# EAGLE design ContactlessMain (EAGLE 9.6.2)
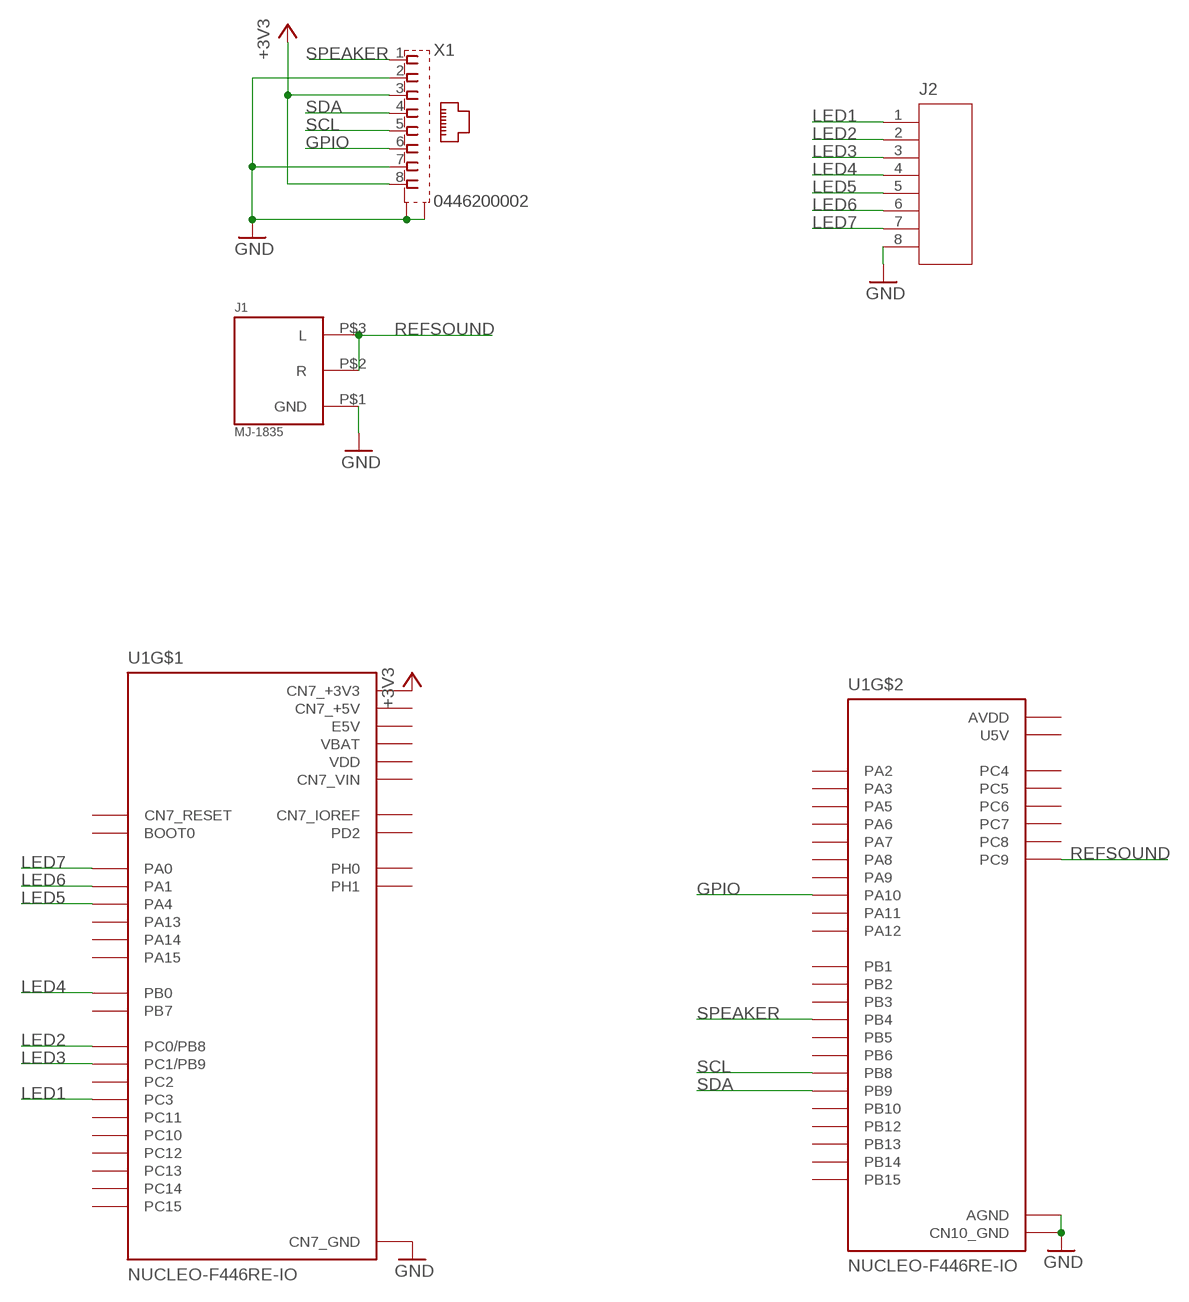
[diagram p0: schematic, sheet 1]

## Parts
J1  MJ-1835  [MJ-1835]
J2  PINHEADER-818*1  [PINHEADER-8*1]
U1  NUCLEO-F446RE-IO  [MODULE_NUCLEO-F446RE]
X1  0446200002  [0446200002]

## Nets
+3V3: U1.CN7_16(CN7_+3V3) X1.3 X1.8
GND: J1.P$1(GND) J2.8 U1.CN7_8(CN7_GND) U1.CN7_19(CN7_GND) U1.CN7_20(CN7_GND) U1.CN7_22(CN7_GND) U1.CN10_9(CN10_GND) U1.CN10_20(CN10_GND) U1.CN10_32(AGND) X1.2 X1.7 X1.S@1(S1) X1.S@2(S2)
GPIO: U1.CN10_33(PA10) X1.6
LED1: J2.1 U1.CN7_37(PC3)
LED2: J2.2 U1.CN7_38(PC0/PB8)
LED3: J2.3 U1.CN7_36(PC1/PB9)
LED4: J2.4 U1.CN7_34(PB0)
LED5: J2.5 U1.CN7_32(PA4)
LED6: J2.6 U1.CN7_30(PA1)
LED7: J2.7 U1.CN7_28(PA0)
REFSOUND: J1.P$2(R) J1.P$3(L) U1.CN10_1(PC9)
SCL: U1.CN10_3(PB8) X1.5
SDA: U1.CN10_5(PB9) X1.4
SPEAKER: U1.CN10_27(PB4) X1.1
Unconnected: U1.CN7_1(PC10) U1.CN7_2(PC11) U1.CN7_3(PC12) U1.CN7_4(PD2) U1.CN7_7(BOOT0) U1.CN7_12(CN7_IOREF) U1.CN7_13(PA13) U1.CN7_14(CN7_RESET) U1.CN7_15(PA14) U1.CN7_17(PA15) U1.CN7_21(PB7) U1.CN7_23(PC13) U1.CN7_25(PC14) U1.CN7_27(PC15) U1.CN7_29(PH0) U1.CN7_31(PH1) U1.CN7_35(PC2) U1.CN10_2(PC8) U1.CN10_4(PC6) U1.CN10_6(PC5) U1.CN10_11(PA5) U1.CN10_12(PA12) U1.CN10_13(PA6) U1.CN10_14(PA11) U1.CN10_15(PA7) U1.CN10_16(PB12) U1.CN10_17(PB6) U1.CN10_19(PC7) U1.CN10_21(PA9) U1.CN10_22(PB2) U1.CN10_23(PA8) U1.CN10_24(PB1) U1.CN10_25(PB10) U1.CN10_26(PB15) U1.CN10_28(PB14) U1.CN10_29(PB5) U1.CN10_30(PB13) U1.CN10_31(PB3) U1.CN10_34(PC4) U1.CN10_35(PA2) U1.CN10_37(PA3)

## Power pins joined to a net without a drawn wire
AVDD: U1.CN10_7(AVDD)
CN7_+5V: U1.CN7_18(CN7_+5V)
CN7_VIN: U1.CN7_24(CN7_VIN)
E5V: U1.CN7_6(E5V)
U5V: U1.CN10_8(U5V)
VBAT: U1.CN7_33(VBAT)
VDD: U1.CN7_5(VDD)

## Library data of the parts
J1 = AUDIO:MJ-1835
J2 = PINHEADER:PINHEADER-8*1
U1 = NUCLEO-F446RE-IO:NUCLEO-F446RE-IO
X1 = con-molex:0446200002: RJ-45 INVERTED MODULAR JACK ASSEMBLY WITH RJ-11 KEEPOUT FEATURE Source: Data sheet <http://www.farnell.com/datasheets/73207.pdf> MOLEX 0446200002 BUCHSE, RJ45, GESCHIRMT Source: Farnell <http://de.farnell.com/molex/0446200002/buchse-rj45-geschirmt/dp/9251910?ost=9251910>; MF: MOLEX; MPN: 0446200002; OC_FARNELL: 9251910

## Board
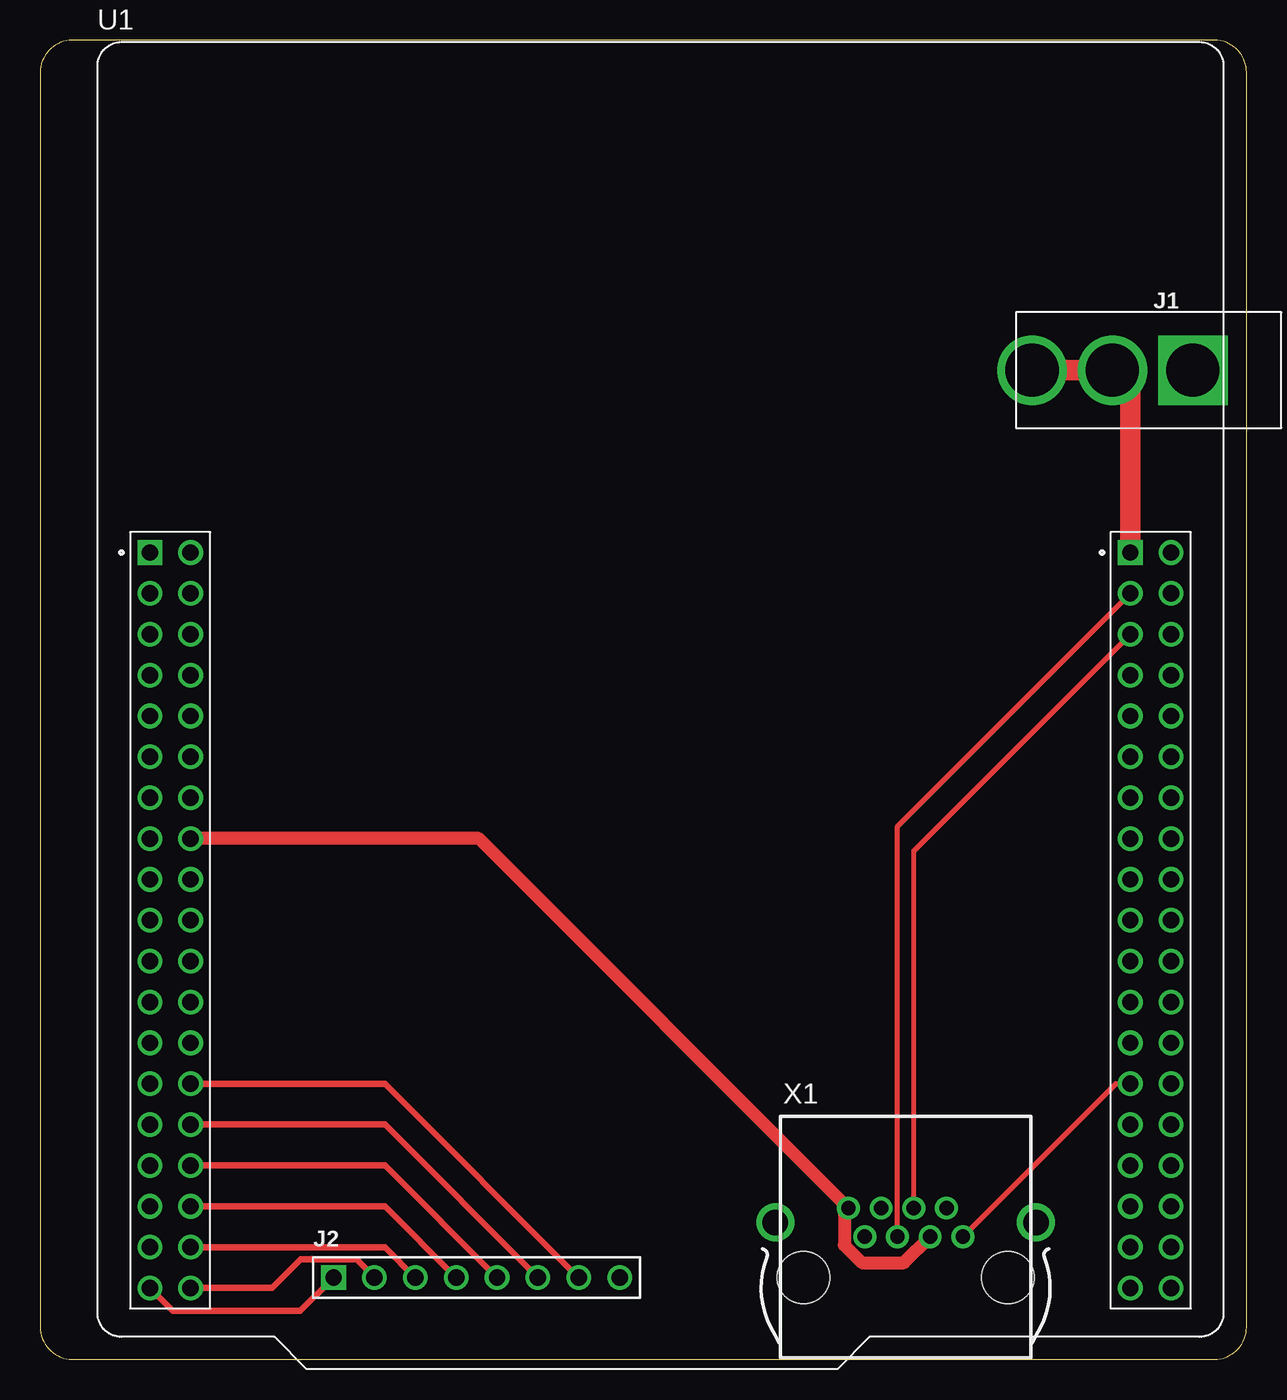
[diagram p1: board, top side]
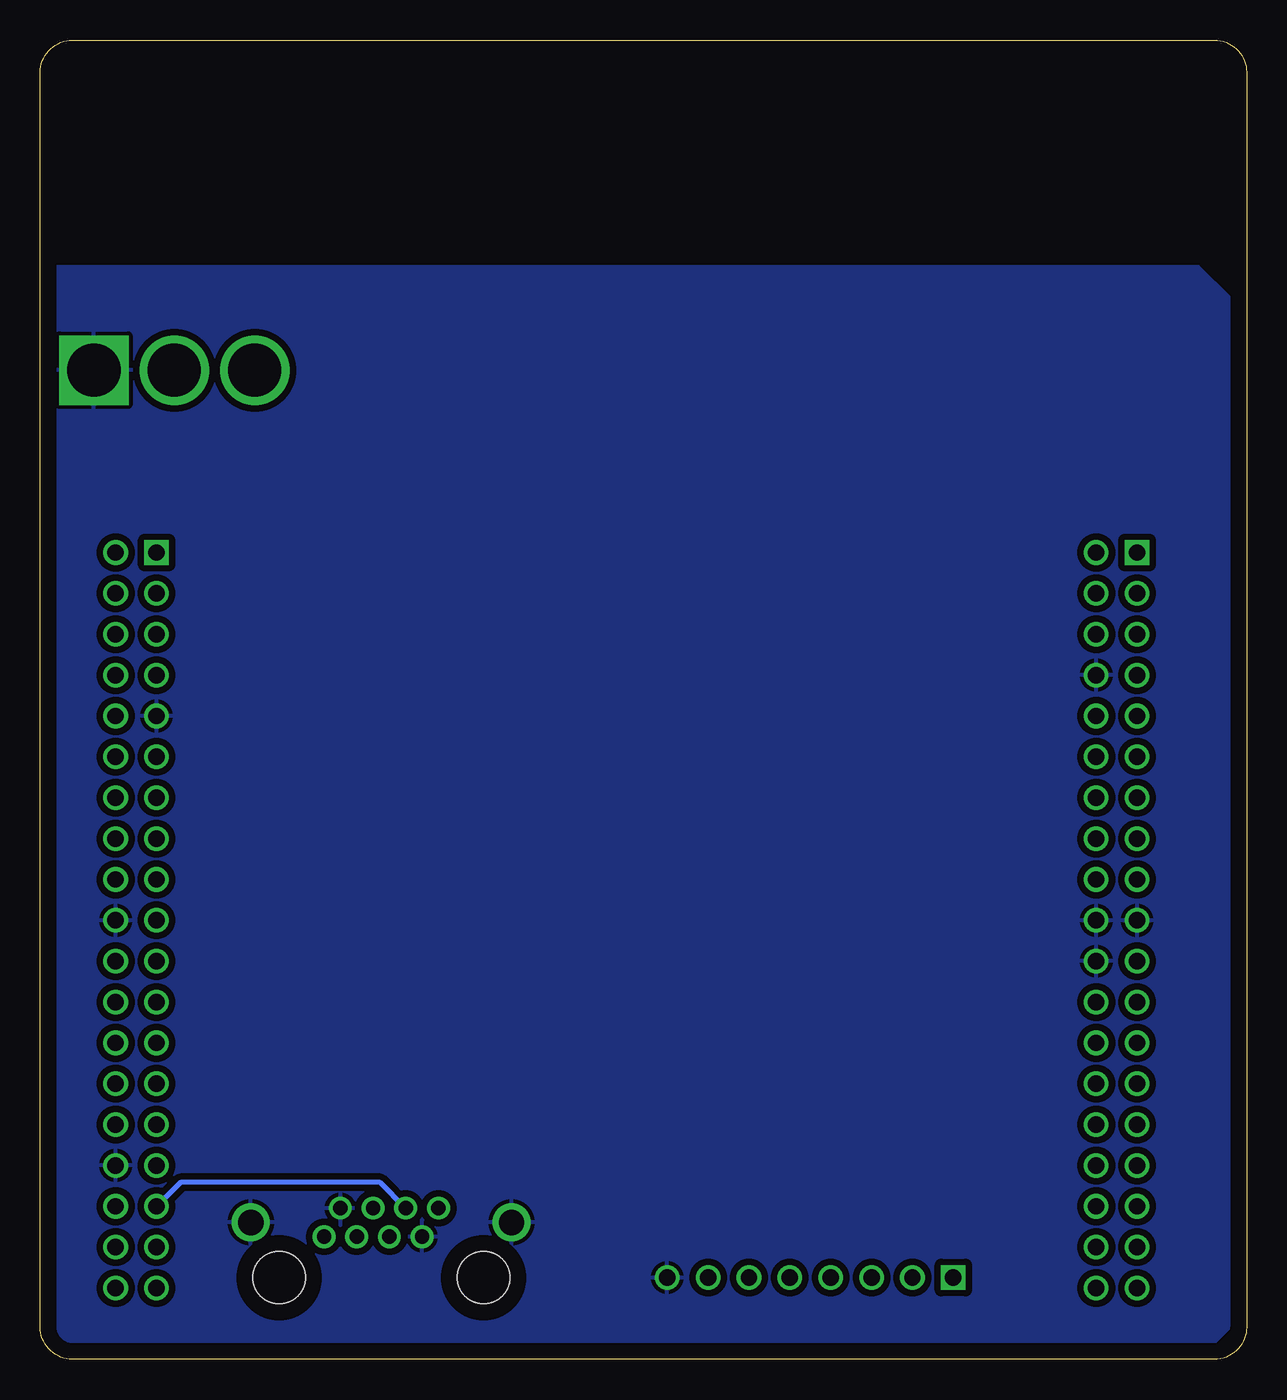
[diagram p2: board, bottom side, seen from below]

Size 75 x 82 mm. Coordinates in mm from the lower left corner, seen from the top.
Outline: 0,80 0,2 arc90 2,0 73,0 arc90 75,2 75,80 arc90 73,82 2,82 arc90 0,80
Copper layers (1*16): Top 0.035mm / dielectric 1.5mm / Bottom 0.035mm
Design rules "default": minimum track width 6mil, minimum drill 0.35mm, track to track 6mil, track to pad 6mil, pad to pad 6mil, via to via 6mil, smd to smd 6mil, copper to edge 40mil, drill to drill 6mil, minimum pad ring 10mil, minimum via ring 8mil, stop-mask expansion 4mil, vias tented up to drill 0mil, thermal gap 10mil

### Footprints (pad centres in the part's own frame; a part is rotated, then mirrored left to right if it is on the bottom)
MJ-1835 = drill 3.3 square: P$1 0,5 | drill 3.3: P$2 0,0; P$3 0,-5
PINHEADER-8*1 = drill 1.02 square: 1 -6.35,0 | drill 1.02: 2 -3.81,0; 3 -1.27,0; 4 1.27,0; 5 3.81,0; 6 6.35,0; 7 8.89,0; 8 11.43,0
MODULE_NUCLEO-F446RE = drill 1.02 square: CN7_1 -31.75,9.51; CN10_1 29.21,9.51 | drill 1.02: CN7_2 -29.21,9.51; CN7_3 -31.75,6.97; CN7_4 -29.21,6.97; CN7_5 -31.75,4.43; CN7_6 -29.21,4.43; CN7_7 -31.75,1.89; CN7_8 -29.21,1.89; CN7_9 -31.75,-0.65; CN7_10 -29.21,-0.65; CN7_11 -31.75,-3.19; CN7_12 -29.21,-3.19; CN7_13 -31.75,-5.73; CN7_14 -29.21,-5.73; CN7_15 -31.75,-8.27; CN7_16 -29.21,-8.27; CN7_17 -31.75,-10.81; CN7_18 -29.21,-10.81; CN7_19 -31.75,-13.35; CN7_20 -29.21,-13.35; CN7_21 -31.75,-15.89; CN7_22 -29.21,-15.89; CN7_23 -31.75,-18.43; CN7_24 -29.21,-18.43; CN7_25 -31.75,-20.97; CN7_26 -29.21,-20.97; CN7_27 -31.75,-23.51; CN7_28 -29.21,-23.51; CN7_29 -31.75,-26.05; CN7_30 -29.21,-26.05; CN7_31 -31.75,-28.59; CN7_32 -29.21,-28.59; CN7_33 -31.75,-31.13; CN7_34 -29.21,-31.13; CN7_35 -31.75,-33.67; CN7_36 -29.21,-33.67; CN7_37 -31.75,-36.21; CN7_38 -29.21,-36.21; CN10_2 31.75,9.51; CN10_3 29.21,6.97; CN10_4 31.75,6.97; CN10_5 29.21,4.43; CN10_6 31.75,4.43; CN10_7 29.21,1.89; CN10_8 31.75,1.89; CN10_9 29.21,-0.65; CN10_10 31.75,-0.65; CN10_11 29.21,-3.19; CN10_12 31.75,-3.19; CN10_13 29.21,-5.73; CN10_14 31.75,-5.73; CN10_15 29.21,-8.27; CN10_16 31.75,-8.27; CN10_17 29.21,-10.81; CN10_18 31.75,-10.81; CN10_19 29.21,-13.35; CN10_20 31.75,-13.35; CN10_21 29.21,-15.89; CN10_22 31.75,-15.89; CN10_23 29.21,-18.43; CN10_24 31.75,-18.43; CN10_25 29.21,-20.97; CN10_26 31.75,-20.97; CN10_27 29.21,-23.51; CN10_28 31.75,-23.51; CN10_29 29.21,-26.05; CN10_30 31.75,-26.05; CN10_31 29.21,-28.59; CN10_32 31.75,-28.59; CN10_33 29.21,-31.13; CN10_34 31.75,-31.13; CN10_35 29.21,-33.67; CN10_36 31.75,-33.67; CN10_37 29.21,-36.21; CN10_38 31.75,-36.21
0446200002 = drill 0.889 pad 1.422: 1 3.556,2.54; 2 2.54,4.318; 3 1.524,2.54; 4 0.508,4.318; 5 -0.508,2.54; 6 -1.524,4.318; 7 -2.54,2.54; 8 -3.556,4.318 | drill 1.575 pad 2.286: S@1 -8.103,3.429; S@2 8.103,3.429 | hole 3.251: 6.35,0; -6.35,0

### Placement (x,y rotation side)
J1  66.66,61.49 270 top
J2  24.59,5.08 0 top
U1  38.56,40.64 0 top
X1  53.8,5.08 0 top

### Tracks (layer width: path | path; a pad name or v marks a point on that pad's centre or on a via)
+3V3
  Top 0.813: X1.3 53.7,6 51.08,6 49.99,7.09 49.99,9.14 X1.8 27.27,32.37 U1.CN7_16
GND
  pour Bottom (isolate 0.406): 74,68 3,68 1,66 1,2 3,0 73,0 75,2 75,67
GPIO
  Bottom 0.305: X1.6 53.88,11 66.28,11 U1.CN10_33
LED1
  Top 0.406: U1.CN7_37 8.24,3 16.16,3 J2.1
LED2
  Top 0.406: U1.CN7_38 14.43,4.43 16.2,6.2 19.66,6.2 J2.2
LED3
  Top 0.406: U1.CN7_36 21.43,6.97 J2.3
LED4
  Top 0.406: U1.CN7_34 21.43,9.51 J2.4
LED5
  Top 0.406: U1.CN7_32 21.43,12.05 J2.5
LED6
  Top 0.406: U1.CN7_30 21.43,14.59 J2.6
LED7
  Top 0.406: U1.CN7_28 21.43,17.13 J2.7
REFSOUND
  Top 1.27: U1.CN10_1 67.77,60.38 J1.P$2 J1.P$3
SCL
  Top 0.305: X1.5 53.29,33.13 U1.CN10_3
SDA
  Top 0.305: X1.4 54.31,31.61 U1.CN10_5
SPEAKER
  Top 0.305: X1.1 66.87,17.13 U1.CN10_27